# Altium project MIXR Input and Processing.PrjPcb (part 2 of 6)

## Sheet MIXR Processing - STM32 USB-UART Converter.SchDoc: STM32F767 DSP Microcontroller - USB - UART
size B; Organization: Midnight Sun Solar Rayce Car Team; Address1: University of Waterloo; Address2: 200 University Ave W; Address3: Waterloo, ON, Canada; Address4: N2L 3E9; DocumentNumber: 13; SheetNumber: 13; SheetTotal: 15; Website: www.uwmidsun.com; ProjectName: ProjectName
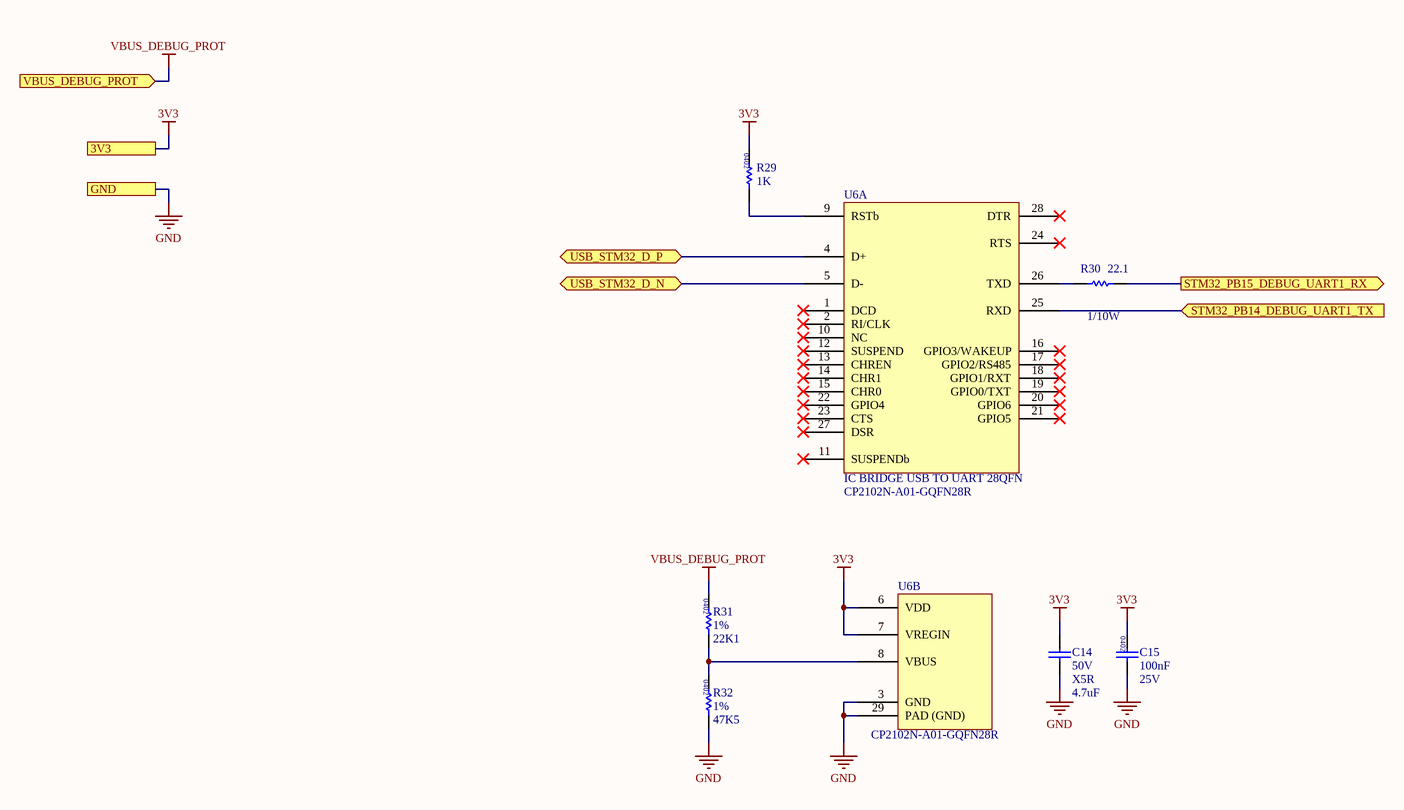
[diagram p2: MIXR Processing - STM32 USB-UART Converter.SchDoc]

### Parts
C14  value 4.7uF  Voltage - Rated: 50V  Temperature Coefficient: X5R  [CAP, 0805]  (hidden comment: CAP CER 4.7UF 50V 10% X5R 0805)
C15  Capacitance: 100nF  Voltage: 25V  [CAP 0402]  (hidden comment: CAP CER 0.1UF 16V X7R 0402)
R29  Resistance: 1K  [RES 0402]  (hidden comment: RES 1K OHM 0.1% 1/16W 0402)
R30  Resistance: 22.1  Power: 1/10W  [RES, 0603]  (hidden comment: RES 22.1 OHM 1% 1/10W 0603)
R31  Tolerance: 1%  Resistance: 22K1  [RES 0402]  (hidden comment: RES 22.1K OHM 1% 1/16W 0402)
R32  Tolerance: 1%  Resistance: 47K5  [RES 0402]  (hidden comment: RES 47.5K OHM 1% 1/16W 0402)
U6  IC BRIDGE USB TO UART 28QFN  Manufacturer Part Number: CP2102N-A01-GQFN28R  [QFN50P500X500X80_HS-29M]  (parts A,B of 2)

### Ports
3V3, GND, STM32_PB14_DEBUG_UART1_TX (in), STM32_PB15_DEBUG_UART1_RX (out), USB_STM32_D_N (bidir), USB_STM32_D_P (bidir), VBUS_DEBUG_PROT (in)

### Nets
3V3: C14.1 C15.1 R29.1 U6.6(VDD) U6.7(VREGIN) ; port 3V3
GND: C14.2 C15.2 R32.2 U6.3(GND) U6.29(PAD_(GND)) ; port GND
VBUS_DEBUG_PROT: R31.1 ; port VBUS_DEBUG_PROT
STM32_PB14_DEBUG_UART1_TX: U6.25(RXD) ; port STM32_PB14_DEBUG_UART1_TX
STM32_PB15_DEBUG_UART1_RX: R30.2 ; port STM32_PB15_DEBUG_UART1_RX
USB_STM32_D_N: U6.5(D-) ; port USB_STM32_D_N
USB_STM32_D_P: U6.4(D+) ; port USB_STM32_D_P
NetR29_2: R29.2 U6.9(RSTb)
NetR30_1: R30.1 U6.26(TXD)
NetR31_2: R31.2 R32.1 U6.8(VBUS)

Not connected (* = marked no-connect by the designer): U6 1(DCD)* 2(RI/CLK)* 10(NC)* 11(SUSPENDb)* 12(SUSPEND)* 13(CHREN)* 14(CHR1)* 15(CHR0)* 16(GPIO3/WAKEUP)* 17(GPIO2/RS485)* 18(GPIO1/RXT)* 19(GPIO0/TXT)* 20(GPIO6)* 21(GPIO5)* 22(GPIO4)* 23(CTS)* 24(RTS)* 27(DSR)* 28(DTR)*

### Notes on the sheet
- PROJECT
- DOCUMENT
- DRAWN BY
- LAST MODIFIED
- PART NUMBER
- REVISION
- SHEET
- VARIANT
- OF

### Library data of the parts
C14 = CAP CER 4.7UF 50V 10% X5R 0805: 4.7µF ±20% 50V Ceramic Capacitor X5R 0805 (2012 Metric); Manufacturer 1: Murata Electronics North America; Manufacturer Part Number 1: GRT21BR61H475ME13L; Description 1: CAP CER 4.7UF 50V X5R 0805; Supplier 1: Digi-Key; Supplier Part Number 1: 490-12395-1-ND; RoHS: RoHS Compliant; Category: Capacitors; Stock 1: 4286; Pricing 1: 1=0.56, 10=0.389, 100=0.2338, 500=0.17536, 1000=0.14808 (CAD); Packaging: Cut Tape (CT); Part Status: Active; Tolerance: ±20%; Operating Temperature: -55°C ~ 85°C; Features: -; Ratings: AEC-Q200; Applications: Automotive; Mounting Type: Surface Mount, MLCC; Package / Case: 0805 (2012 Metric); Size / Dimension: 0.079" L x 0.049" W (2.00mm x 1.25mm); Height - Seated (Max): -; Thickness (Max): 0.057" (1.45mm); Lead Spacing: -; Lead Style: -; ComponentLink1URL: http://search.murata.co.jp/Ceramy/image/img/A01X/G101/ENG/GRT21BR61H475ME13-01.pdf; ComponentLink1Description: http://search.murata.co.jp/Ceramy/image/img/A01X/G101/ENG/GRT21BR61H475ME13-01.pdf
C15 = CAP CER 0.1UF 16V X7R 0402: Cap Ceramic 0.1uF 25V X7R 10% SMD 0402 125C Paper T/R; Manufacturer: Murata; Manufacturer Part Number: GRM155R71E104KE14D; Supplier 1: Digi-Key; Supplier Part Number 1: 490-10698-1-ND; Packaging: Tape and Reel; ComponentLink1URL: http://www.farnell.com/datasheets/2048008.pdf?src-supplier=Farnell; ComponentLink1Description: http://www.farnell.com/datasheets/2048008.pdf?src-supplier=Farnell; Tolerance: 10%; RoHS: Yes; Category: Ceramic Capacitors; Stock 1: 785540; Pricing 1: 1=0.10000, 10=0.03400, 100=0.01520, 500=0.01088, 1000=0.00855, 2500=0.00778, 5000=0.00715 (USD); Mount: Surface Mount; Case/Package: 0402; Weight: 0.000212oz; Case Code (Metric): 1005; Case Code (Imperial): 0402; Dielectric Material: Ceramic; Min Operating Temperature: -55°C; Max Operating Temperature: 125°C; Termination: SMD/SMT; Composition: Ceramic; Voltage Rating (DC): 25V; Package Quantity: 10000; Length: 1mm; Height: 0.5mm; Width: 0.02inch; Thickness: 0.022inch; Depth: 0.5mm; REACH SVHC: Unknown; Lead Free: Lead Free; ComponentLink2URL: http://uk.rs-online.com/webdocs/144c/0900766b8144c113.pdf?src-supplier=RSComponents; ComponentLink2Description: http://uk.rs-online.com/webdocs/144c/0900766b8144c113.pdf?src-supplier=RSComponents; ComponentLink3URL: http://www.farnell.com/datasheets/1872206.pdf?src-supplier=Farnell; ComponentLink3Description: http://www.farnell.com/datasheets/1872206.pdf?src-supplier=Farnell; ComponentLink4URL: http://components.arrow.com/part/dataview/0323_06361249?src-supplier=Arrow+Europe; ComponentLink4Description: http://components.arrow.com/part/dataview/0323_06361249?src-supplier=Arrow+Europe; ComponentLink5URL: http://www.mouser.com/ds/2/281/c02e-2905.pdf?src-supplier=Mouser; ComponentLink5Description: http://www.mouser.com/ds/2/281/c02e-2905.pdf?src-supplier=Mouser; ComponentLink6URL: http://www.farnell.com/datasheets/2048008.pdf?src-supplier=Newark; ComponentLink6Description: http://www.farnell.com/datasheets/2048008.pdf?src-supplier=Newark; ComponentLink7URL: http://psearch.en.murata.com/capacitor/product/GRM155R71E104KE14%23.pdf?src-supplier=Avnet; ComponentLink7Description: http://psearch.en.murata.com/capacitor/product/GRM155R71E104KE14%23.pdf?src-supplier=Avnet; ComponentLink8URL: https://search.murata.co.jp/Ceramy/image/img/A01X/G101/ENG/GRM155R71E104KE14-01.pdf?src-supplier=Digi-Key; ComponentLink8Description: https://search.murata.co.jp/Ceramy/image/img/A01X/G101/ENG/GRM155R71E104KE14-01.pdf?src-supplier=Digi-Key; ComponentLink9URL: http://www.farnell.com/datasheets/2048008.pdf?src-supplier=Element14; ComponentLink9Description: http://www.farnell.com/datasheets/2048008.pdf?src-supplier=Element14; Dielectric: X7R; Voltage Rating: 25V
R29 = RES 1K OHM 0.1% 1/16W 0402: RES SMD 1K OHM 0.1% 1/16W 0402; Manufacturer: Yageo; Manufacturer Part Number: RT0402BRE071KL; Temperature Coefficient: 50ppm/°C; Power Rating: 62.5mW; Voltage Rating: 50V; Max Power Dissipation: 63mW; Supplier 1: Digi-Key; Supplier Part Number 1: YAG2306CT-ND; RoHS: Yes; Category: Chip SMD Resistors; Stock 1: 46127; Pricing 1: 1=0.41000, 10=0.29200, 100=0.11690, 1000=0.05758, 2500=0.05335, 5000=0.04827 (USD); Packaging: Tape and Reel; Tolerance: 0.1%; Composition: Thin Film; Features: Moisture Resistant; ComponentLink1URL: https://datasheet.ciiva.com/2582/pyu-rt-1-to-0-05-rohs-l-5-2582672.pdf?src-supplier=Digi-Key; ComponentLink1Description: https://datasheet.ciiva.com/2582/pyu-rt-1-to-0-05-rohs-l-5-2582672.pdf?src-supplier=Digi-Key; Case/Package: 0402; Weight: 2.3E-05oz; Case Code (Metric): 1005; Case Code (Imperial): 0402; Min Operating Temperature: -55°C; Max Operating Temperature: 125°C; Package Quantity: 10000; Number of Terminations: 2; Termination: SMD/SMT; Military Standard: Not; Voltage Rating (DC): 50V; Length: 1mm; Height: 0.014inch; Width: 0.02inch; Depth: 0.5mm; Lead Free: Lead Free; ComponentLink2URL: https://datasheet.ciiva.com/12796/pyu-rt-1-to-0-05-rohs-l-4-12796476.pdf?src-supplier=Mouser; ComponentLink2Description: https://datasheet.ciiva.com/12796/pyu-rt-1-to-0-05-rohs-l-4-12796476.pdf?src-supplier=Mouser
R30 = RES 22.1 OHM 1% 1/10W 0603: 22.1 Ohm ±1% 0.1W, 1/10W Chip Resistor 0603 (1608 Metric) Moisture Resistant Thick Film; Manufacturer 1: Yageo; Manufacturer Part Number 1: RC0603FR-0722R1L; Temperature Coefficient: ±100ppm/°C; Supplier 1: Digi-Key; Supplier Part Number 1: 311-22.1HRCT-ND; Packaging: Cut Tape (CT); Composition: Thick Film; ComponentLink1URL: http://www.yageo.com/documents/recent/PYu-RC_Group_51_RoHS_L_7.pdf; ComponentLink1Description: http://www.yageo.com/documents/recent/PYu-RC_Group_51_RoHS_L_7.pdf; Tolerance: ±1%; Part Status: Active; Operating Temperature: -55°C ~ 155°C; Package / Case: 0603 (1608 Metric); Supplier Device Package: 0603; Size / Dimension: 0.063" L x 0.031" W (1.60mm x 0.80mm); Height - Seated (Max): 0.022" (0.55mm); Failure Rate: -
R31 = RES 22.1K OHM 1% 1/16W 0402: RES SMD 22.1K OHM 1% 1/16W 0402; Manufacturer: Stackpole Electronics; Manufacturer Part Number: RMCF0402FT22K1; Max Power Dissipation: 63mW; Temperature Coefficient: 100ppm/°C; Supplier 1: Digi-Key; RoHS: Yes; Category: Chip SMD Resistors; Stock 1: 130160; Pricing 1: 1=0.10000, 10=0.01400, 100=0.00580, 1000=0.00262, 2500=0.00228, 5000=0.00188 (USD); Mount: Surface Mount; Case/Package: 0402; Case Code (Metric): 1005; Case Code (Imperial): 0402; Contact Plating: Tin,Matte; Min Operating Temperature: -55°C; Max Operating Temperature: 155°C; Packaging: Tape and Reel; Composition: Thick Film; Number of Terminations: 2; Features: Automotive AEC-Q200; Length: 0.039inch; Height: 0.016inch; Width: 0.02inch; Radiation Hardening: No; Lead Free: Lead Free; ComponentLink1URL: http://components.arrow.com/part/dataview/50500388S32218N1174?src-supplier=Arrow; ComponentLink1Description: http://components.arrow.com/part/dataview/50500388S32218N1174?src-supplier=Arrow; ComponentLink2URL: https://www.seielect.com/Catalog/SEI-RMCF_RMCP.pdf?src-supplier=Digi-Key; ComponentLink2Description: https://www.seielect.com/Catalog/SEI-RMCF_RMCP.pdf?src-supplier=Digi-Key; ComponentLink3URL: https://www.seielect.com/catalog/SEI-RMCF_RMCP.pdf?src-supplier=Avnet; ComponentLink3Description: https://www.seielect.com/catalog/SEI-RMCF_RMCP.pdf?src-supplier=Avnet; ComponentLink4URL: https://www.seielect.com/catalog/SEI-Packaging.pdf?src-supplier=Digi-Key; ComponentLink4Description: https://www.seielect.com/catalog/SEI-Packaging.pdf?src-supplier=Digi-Key; Supplier Part Number 1: RMCF0402FT22K1CT-ND
R32 = RES 47.5K OHM 1% 1/16W 0402: RES SMD 47.5K OHM 1% 1/16W 0402; Manufacturer: Yageo; Manufacturer Part Number: RC0402FR-0747K5L; Power Rating: 62.5mW; Temperature Coefficient: 100ppm/°C; Voltage Rating: 50V; Supplier 1: Digi-Key; RoHS: Yes; Category: Chip SMD Resistors; Stock 1: 1151028; Pricing 1: 1=0.10000, 10=0.01600, 100=0.00640, 1000=0.00289, 2500=0.00251, 5000=0.00207 (USD); Case/Package: 0402; Case Code (Metric): 1005; Case Code (Imperial): 0402; Min Operating Temperature: -55°C; Max Operating Temperature: 155°C; Packaging: Tape and Reel; Composition: Thick Film; Military Standard: Not; Length: 1mm; Depth: 0.5mm; Lead Free: Lead Free; ComponentLink1URL: https://datasheet.ciiva.com/16746/pyu-rc0402-51-rohs-l-6-r-16746316.pdf?src-supplier=Future+Electronics; ComponentLink1Description: https://datasheet.ciiva.com/16746/pyu-rc0402-51-rohs-l-6-r-16746316.pdf?src-supplier=Future+Electronics; Supplier Part Number 1: 311-47.5KLRCT-ND; Termination: SMD/SMT; Voltage Rating (DC): 50V; REACH SVHC: No SVHC; ComponentLink2URL: https://datasheet.ciiva.com/46394/1018594-46394942.pdf?src-supplier=Element14; ComponentLink2Description: https://datasheet.ciiva.com/46394/1018594-46394942.pdf?src-supplier=Element14; ComponentLink3URL: https://datasheet.ciiva.com/12667/pyu-rc0402-51-rohs-l-6-r-12667103.pdf?src-supplier=Mouser; ComponentLink3Description: https://datasheet.ciiva.com/12667/pyu-rc0402-51-rohs-l-6-r-12667103.pdf?src-supplier=Mouser
U6 = IC BRIDGE USB TO UART 28QFN: Manufacturer: Silicon Labs; Supplier 1: Digi-Key; RoHS: No; Stock 1: 2155; Pricing 1: 1=1.40000, 25=1.35160, 100=1.29950 (USD); ComponentLink1URL: https://www.silabs.com/documents/public/data-sheets/cp2102n-datasheet.pdf?src-supplier=Digi-Key; ComponentLink1Description: https://www.silabs.com/documents/public/data-sheets/cp2102n-datasheet.pdf?src-supplier=Digi-Key; Supplier Part Number 1: 336-4738-1-ND

## Sheet MIXR Processing - STM32 DSP Microcontroller.SchDoc: STM32F767 DSP Microcontroller - GPIOs
size B; DocumentNumber: 10; SheetNumber: 10; SheetTotal: 15
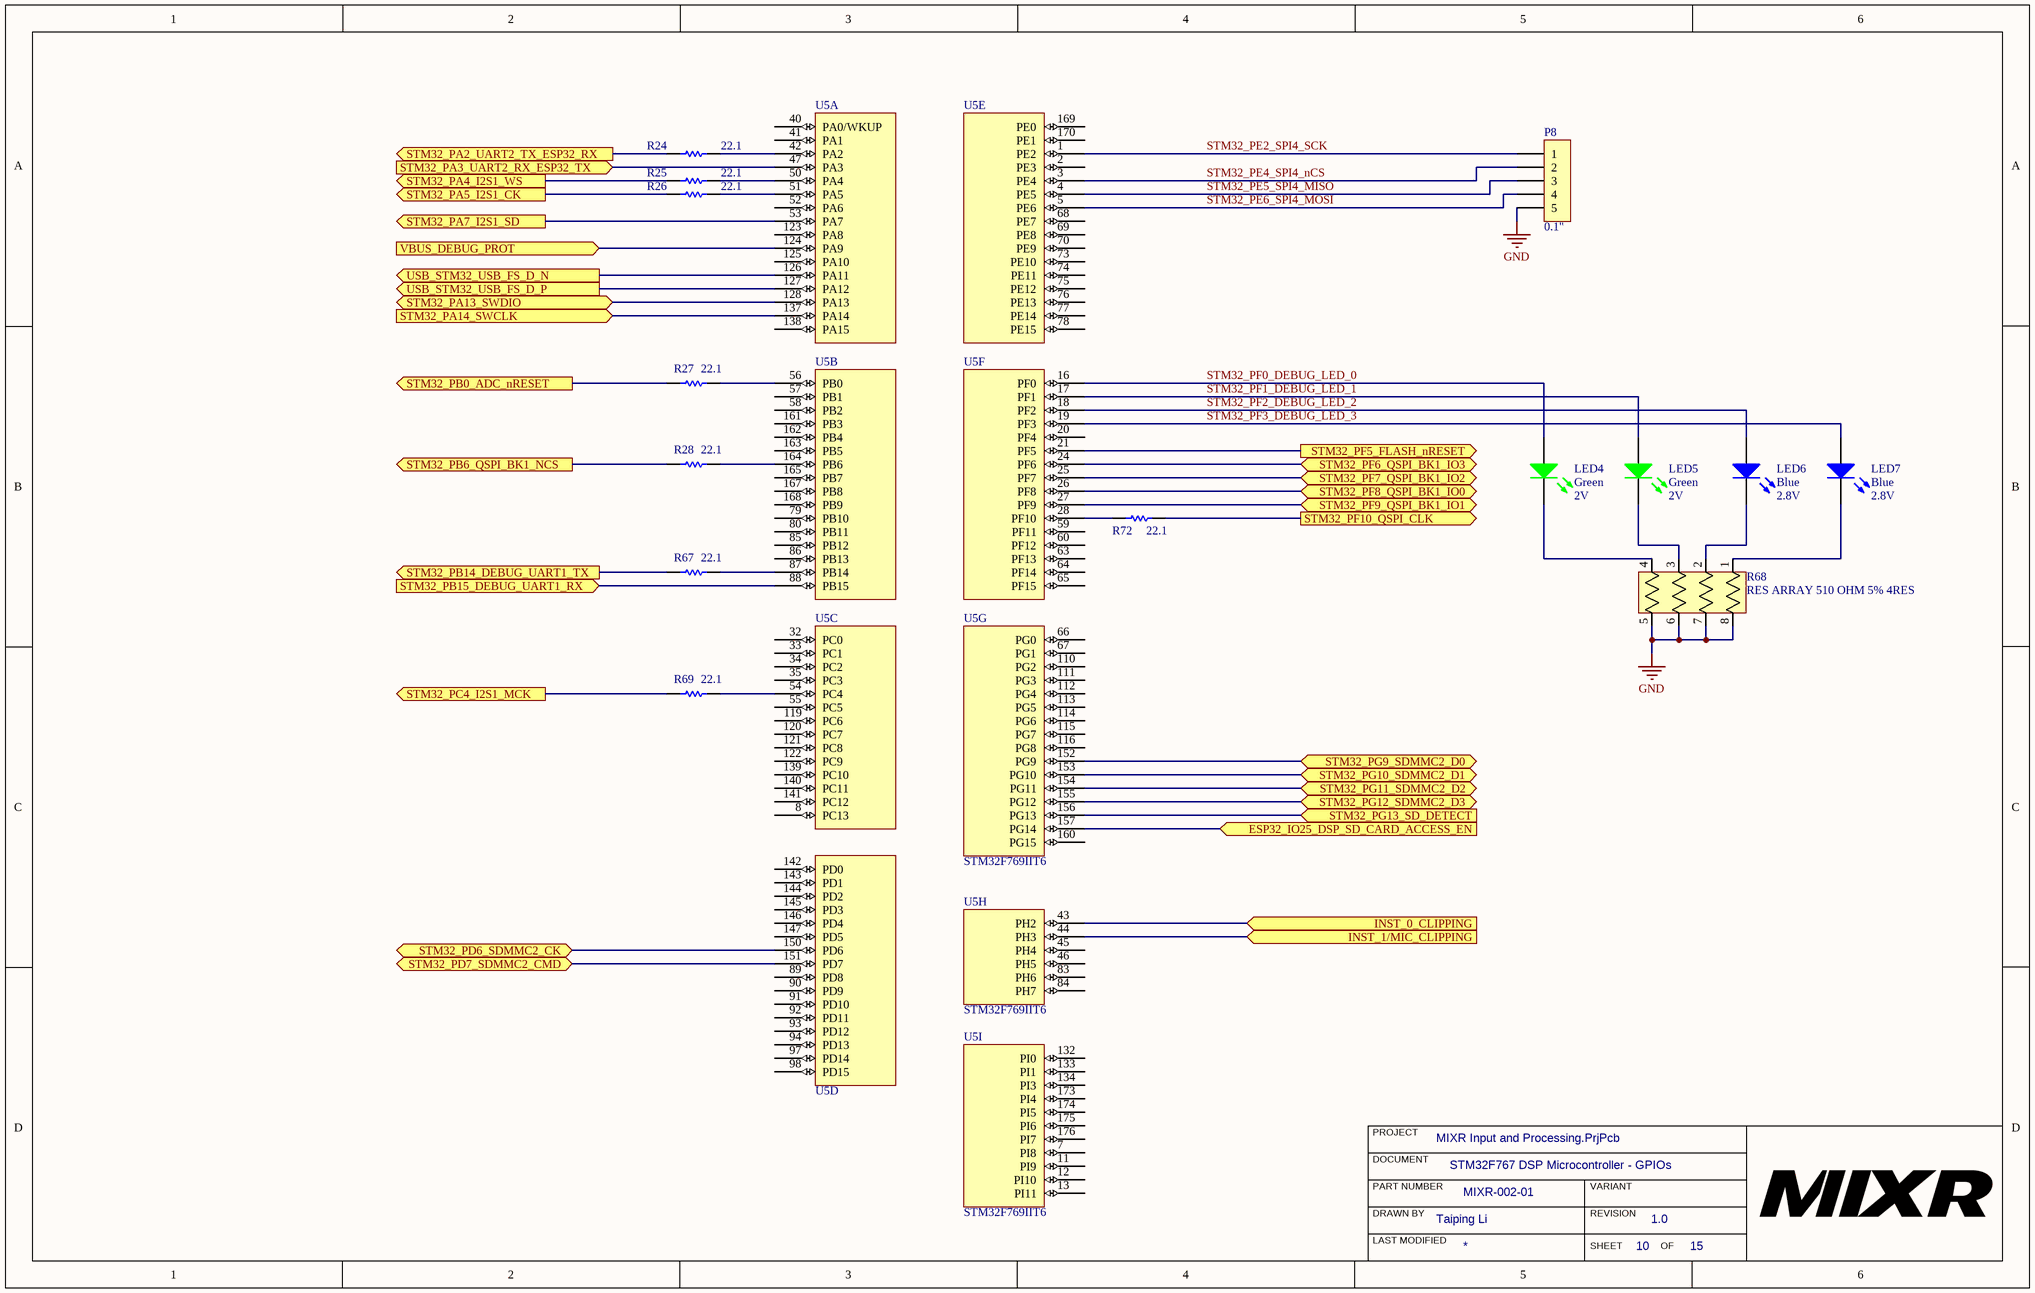
[diagram p3: MIXR Processing - STM32 DSP Microcontroller.SchDoc]

### Parts
LED4  Color: Green  Voltage - Forward (Vf) (Typ): 2V  [LED_0603]  (hidden comment: LED GREEN CLEAR 2V 0603)
LED5  Color: Green  Voltage - Forward (Vf) (Typ): 2V  [LED_0603]  (hidden comment: LED GREEN CLEAR 2V 0603)
LED6  Color: Blue  Voltage - Forward (Vf) (Typ): 2.8V  [LED_0603]  (hidden comment: LED BLUE CLEAR 2.8V 0603)
LED7  Color: Blue  Voltage - Forward (Vf) (Typ): 2.8V  [LED_0603]  (hidden comment: LED BLUE CLEAR 2.8V 0603)
P8  0.1"  [CONN, 5POS 1.23" 0.100" MALE Header]
R24  Resistance: 22.1  [RES, 0603]  (hidden comment: RES 22.1 OHM 1% 1/10W 0603)
R25  Resistance: 22.1  [RES, 0603]  (hidden comment: RES 22.1 OHM 1% 1/10W 0603)
R26  Resistance: 22.1  [RES, 0603]  (hidden comment: RES 22.1 OHM 1% 1/10W 0603)
R27  Resistance: 22.1  [RES, 0603]  (hidden comment: RES 22.1 OHM 1% 1/10W 0603)
R28  Resistance: 22.1  [RES, 0603]  (hidden comment: RES 22.1 OHM 1% 1/10W 0603)
R67  Resistance: 22.1  [RES, 0603]  (hidden comment: RES 22.1 OHM 1% 1/10W 0603)
R68  RES ARRAY 510 OHM 5% 4RES  [RES ARRAY 4 POS 0804]
R69  Resistance: 22.1  [RES, 0603]  (hidden comment: RES 22.1 OHM 1% 1/10W 0603)
R72  Resistance: 22.1  [RES, 0603]  (hidden comment: RES 22.1 OHM 1% 1/10W 0603)
U5  IC MCU STM32F769II 176-LQFP  [TSQFP50P2600X2600X160-176M]  (value not drawn)  (parts A,B,C,D,E,F,G,H,I of 11)

### Ports
ESP32_IO25_DSP_SD_CARD_ACCESS_EN (in), INST_0_CLIPPING (in), INST_1/MIC_CLIPPING (in), STM32_PA2_UART2_TX_ESP32_RX (out), STM32_PA3_UART2_RX_ESP32_TX (in), STM32_PA4_I2S1_WS (out), STM32_PA5_I2S1_CK (out), STM32_PA7_I2S1_SD (out), STM32_PA13_SWDIO (bidir), STM32_PA14_SWCLK (in), STM32_PB0_ADC_nRESET (out), STM32_PB6_QSPI_BK1_NCS (out), STM32_PB14_DEBUG_UART1_TX (out), STM32_PB15_DEBUG_UART1_RX (in), STM32_PC4_I2S1_MCK (out), STM32_PD6_SDMMC2_CK (bidir), STM32_PD7_SDMMC2_CMD (bidir), STM32_PF5_FLASH_nRESET (out), STM32_PF6_QSPI_BK1_IO3 (bidir), STM32_PF7_QSPI_BK1_IO2 (bidir), STM32_PF8_QSPI_BK1_IO0 (bidir), STM32_PF9_QSPI_BK1_IO1 (bidir), STM32_PF10_QSPI_CLK (out), STM32_PG9_SDMMC2_D0 (bidir), STM32_PG10_SDMMC2_D1 (bidir), STM32_PG11_SDMMC2_D2 (bidir), STM32_PG12_SDMMC2_D3 (bidir), STM32_PG13_SD_DETECT (in), USB_STM32_USB_FS_D_N (out), USB_STM32_USB_FS_D_P (out), VBUS_DEBUG_PROT (in)

### Nets
GND: P8.5 R68.5 R68.6 R68.7 R68.8
VBUS_DEBUG_PROT: U5.124(PA9) ; port VBUS_DEBUG_PROT
ESP32_IO25_DSP_SD_CARD_ACCESS_EN: U5.157(PG14) ; port ESP32_IO25_DSP_SD_CARD_ACCESS_EN
INST_0_CLIPPING: U5.43(PH2) ; port INST_0_CLIPPING
INST_1/MIC_CLIPPING: U5.44(PH3) ; port INST_1/MIC_CLIPPING
STM32_PA2_UART2_TX_ESP32_RX: R24.1 ; port STM32_PA2_UART2_TX_ESP32_RX
STM32_PA3_UART2_RX_ESP32_TX: U5.47(PA3) ; port STM32_PA3_UART2_RX_ESP32_TX
STM32_PA4_I2S1_WS: R25.1 ; port STM32_PA4_I2S1_WS
STM32_PA5_I2S1_CK: R26.1 ; port STM32_PA5_I2S1_CK
STM32_PA7_I2S1_SD: U5.53(PA7) ; port STM32_PA7_I2S1_SD
STM32_PA13_SWDIO: U5.128(PA13) ; port STM32_PA13_SWDIO
STM32_PA14_SWCLK: U5.137(PA14) ; port STM32_PA14_SWCLK
STM32_PB0_ADC_nRESET: R27.1 ; port STM32_PB0_ADC_nRESET
STM32_PB6_QSPI_BK1_NCS: R28.1 ; port STM32_PB6_QSPI_BK1_NCS
STM32_PB14_DEBUG_UART1_TX: R67.1 ; port STM32_PB14_DEBUG_UART1_TX
STM32_PB15_DEBUG_UART1_RX: U5.88(PB15) ; port STM32_PB15_DEBUG_UART1_RX
STM32_PC4_I2S1_MCK: R69.1 ; port STM32_PC4_I2S1_MCK
STM32_PD6_SDMMC2_CK: U5.150(PD6) ; port STM32_PD6_SDMMC2_CK
STM32_PD7_SDMMC2_CMD: U5.151(PD7) ; port STM32_PD7_SDMMC2_CMD
STM32_PE2_SPI4_SCK: P8.1 U5.1(PE2)
STM32_PE4_SPI4_nCS: P8.2 U5.3(PE4)
STM32_PE5_SPI4_MISO: P8.3 U5.4(PE5)
STM32_PE6_SPI4_MOSI: P8.4 U5.5(PE6)
STM32_PF0_DEBUG_LED_0: LED4.1(A) U5.16(PF0)
STM32_PF1_DEBUG_LED_1: LED5.1(A) U5.17(PF1)
STM32_PF2_DEBUG_LED_2: LED6.1(A) U5.18(PF2)
STM32_PF3_DEBUG_LED_3: LED7.1(A) U5.19(PF3)
STM32_PF5_FLASH_nRESET: U5.21(PF5) ; port STM32_PF5_FLASH_nRESET
STM32_PF6_QSPI_BK1_IO3: U5.24(PF6) ; port STM32_PF6_QSPI_BK1_IO3
STM32_PF7_QSPI_BK1_IO2: U5.25(PF7) ; port STM32_PF7_QSPI_BK1_IO2
STM32_PF8_QSPI_BK1_IO0: U5.26(PF8) ; port STM32_PF8_QSPI_BK1_IO0
STM32_PF9_QSPI_BK1_IO1: U5.27(PF9) ; port STM32_PF9_QSPI_BK1_IO1
STM32_PF10_QSPI_CLK: R72.2 ; port STM32_PF10_QSPI_CLK
STM32_PG9_SDMMC2_D0: U5.152(PG9) ; port STM32_PG9_SDMMC2_D0
STM32_PG10_SDMMC2_D1: U5.153(PG10) ; port STM32_PG10_SDMMC2_D1
STM32_PG11_SDMMC2_D2: U5.154(PG11) ; port STM32_PG11_SDMMC2_D2
STM32_PG12_SDMMC2_D3: U5.155(PG12) ; port STM32_PG12_SDMMC2_D3
STM32_PG13_SD_DETECT: U5.156(PG13) ; port STM32_PG13_SD_DETECT
USB_STM32_USB_FS_D_N: U5.126(PA11) ; port USB_STM32_USB_FS_D_N
USB_STM32_USB_FS_D_P: U5.127(PA12) ; port USB_STM32_USB_FS_D_P
NetLED4_2: LED4.2(K) R68.4
NetLED5_2: LED5.2(K) R68.3
NetLED6_2: LED6.2(K) R68.2
NetLED7_2: LED7.2(K) R68.1
NetR24_2: R24.2 U5.42(PA2)
NetR25_2: R25.2 U5.50(PA4)
NetR26_2: R26.2 U5.51(PA5)
NetR27_2: R27.2 U5.56(PB0)
NetR28_2: R28.2 U5.164(PB6)
NetR67_2: R67.2 U5.87(PB14)
NetR69_2: R69.2 U5.54(PC4)
NetR72_1: R72.1 U5.28(PF10)

Not connected (* = marked no-connect by the designer): U5 2(PE3) 7(PI8) 8(PC13) 11(PI9) 12(PI10) 13(PI11) 20(PF4) 32(PC0) 33(PC1) 34(PC2) 35(PC3) 40(PA0/WKUP) 41(PA1) 45(PH4) 46(PH5) 52(PA6) 55(PC5) 57(PB1) 58(PB2) 59(PF11) 60(PF12) 63(PF13) 64(PF14) 65(PF15) 66(PG0) 67(PG1) 68(PE7) 69(PE8) 70(PE9) 73(PE10) 74(PE11) 75(PE12) 76(PE13) 77(PE14) 78(PE15) 79(PB10) 80(PB11) 83(PH6) 84(PH7) 85(PB12) 86(PB13) 89(PD8) 90(PD9) 91(PD10) 92(PD11) 93(PD12) 94(PD13) 97(PD14) 98(PD15) 110(PG2) 111(PG3) 112(PG4) 113(PG5) 114(PG6) 115(PG7) 116(PG8) 119(PC6) 120(PC7) 121(PC8) 122(PC9) 123(PA8) 125(PA10) 132(PI0) 133(PI1) 134(PI3) 138(PA15) 139(PC10) 140(PC11) 141(PC12) 142(PD0) 143(PD1) 144(PD2) 145(PD3) 146(PD4) 147(PD5) 160(PG15) 161(PB3) 162(PB4) 163(PB5) 165(PB7) 167(PB8) 168(PB9) 169(PE0) 170(PE1) 173(PI4) 174(PI5) 175(PI6) 176(PI7)

### Notes on the sheet
- PROJECT
- DOCUMENT
- DRAWN BY
- LAST MODIFIED
- PART NUMBER
- REVISION
- SHEET
- VARIANT
- OF

### Library data of the parts
LED4 LED5 = LED GREEN CLEAR 2V 0603: Green 572nm LED Indication - Discrete 2V 0603 (1608 Metric); Manufacturer: Wurth Electronics Inc.; Manufacturer Part Number: 150060VS75000; Lens Color: Colorless; Millicandela Rating: 40mcd; Lens Style/Size: Rectangle with Flat Top, 1.10mm x 0.70mm; Current - Test: 20mA; Viewing Angle: 140°; Wavelength - Dominant: 570nm; Supplier 1: Digi-Key; RoHS: RoHS Compliant; Category: Optoelectronics; Stock 1: 9408; Pricing 1: 1=0.21, 100=0.1617, 500=0.13964 (CAD); Packaging: Cut Tape (CT); Part Status: Active; Lens Transparency: Clear; Mounting Type: Surface Mount; Wavelength - Peak: 572nm; Features: -; Package / Case: 0603 (1608 Metric); Supplier Device Package: 0603; Size / Dimension: 1.60mm L x 0.80mm W; Height (Max): 0.80mm; ComponentLink1URL: http://katalog.we-online.de/led/datasheet/150060VS75000.pdf; ComponentLink1Description: http://katalog.we-online.de/led/datasheet/150060VS75000.pdf; Supplier Part Number 1: 732-4980-1-ND
LED6 LED7 = LED BLUE CLEAR 2.8V 0603: Blue 470nm LED Indication - Discrete 2.8V 0603 (1608 Metric); Manufacturer 1: Lite-On Inc.; Manufacturer Part Number 1: LTST-C193TBKT-5A; Lens Color: Colorless; Millicandela Rating: 15mcd; Lens Style/Size: Rectangle with Flat Top, 1.15mm x 0.80mm; Current - Test: 5mA; Viewing Angle: 130°; Wavelength - Peak: 468nm; Supplier 1: Digi-Key; Supplier Part Number 1: 160-1827-1-ND; Packaging: Cut Tape (CT); Part Status: Active; Lens Transparency: Clear; Mounting Type: Surface Mount; Wavelength - Dominant: 470nm; Package / Case: 0603 (1608 Metric); Supplier Device Package: Chip LED; Size / Dimension: 1.60mm L x 0.80mm W; Height (Max): 0.45mm; ComponentLink1URL: http://optoelectronics.liteon.com/upload/download/DS22-2004-060/P_100_LTST-C193TBKT-5A.pdf; ComponentLink1Description: http://optoelectronics.liteon.com/upload/download/DS22-2004-060/P_100_LTST-C193TBKT-5A.pdf
P8 = CONN 5POS 0.1" 1" MALE HEADER: CONN HEADER 5POS .100" SNGL; Manufacturer: Samtec; Manufacturer Part Number: TSW-105-20-T-S; Number of Positions: 5; Gender: Male; Connector Type: Male Pin; Pitch: 0.1inch; RoHS: Yes; Category: Headers and Wire Housings; Stock 1: 939; Pricing 1: 1=0.45000, 10=0.42300, 100=0.32430, 500=0.28200, 1000=0.23265, 5000=0.20445, 10000=0.19035 (USD); Mount: Through Hole; Color: Black; Contact Plating: Tin; Contact Material: Bronze; Package Quantity: 1; Number of Rows: 1; Packaging: Rail/Tube; Termination: Solder; Number of Contacts: 5; Contact Mating Length: 1.02inch; Radiation Hardening: No; REACH SVHC: No SVHC; Lead Free: Lead Free; ComponentLink1URL: https://datasheet.ciiva.com/739/tsw-xxx-xx-xxx-x-xx-xxx-mkt-739939.pdf?src-supplier=Digi-Key; ComponentLink1Description: https://datasheet.ciiva.com/739/tsw-xxx-xx-xxx-x-xx-xxx-mkt-739939.pdf?src-supplier=Digi-Key; ComponentLink2URL: https://datasheet.ciiva.com/29947/htsw-th-29947990.pdf?src-supplier=Avnet; ComponentLink2Description: https://datasheet.ciiva.com/29947/htsw-th-29947990.pdf?src-supplier=Avnet; Supplier 1: Digi-Key; Supplier Part Number 1: SAM9000-ND
R24-R28 R67 R69 R72 = RES 22.1 OHM 1% 1/10W 0603: as R30 on sheet MIXR Processing - STM32 USB-UART Converter; Supplier 1: Digi-Key; Supplier Part Number 1: 311-22.1HRCT-ND; Packaging: Cut Tape (CT); Composition: Thick Film; ComponentLink1URL: http://www.yageo.com/documents/recent/PYu-RC_Group_51_RoHS_L_7.pdf; ComponentLink1Description: http://www.yageo.com/documents/recent/PYu-RC_Group_51_RoHS_L_7.pdf; Tolerance: ±1%; Part Status: Active; Operating Temperature: -55°C ~ 155°C; Package / Case: 0603 (1608 Metric); Supplier Device Package: 0603; Size / Dimension: 0.063" L x 0.031" W (1.60mm x 0.80mm); Height - Seated (Max): 0.022" (0.55mm); Failure Rate: -; Power: 1/10W
R68 = RES ARRAY 510 OHM 5% 4RES EXB-N8V511JX: RES ARRAY SMD 510 OHM 5% 4RES EXB-N8V511JX; Manufacturer: Panasonic Electronic Components; Circuit Type: Isolated; Resistance (Ohms): 510; Power Per Element: 31mW; Temperature Coefficient: ±200ppm/°C; Supplier 1: Digi-Key; Manufacturer Part Number: EXB-N8V511JX; RoHS: RoHS Compliant; Category: Resistors; Stock 1: 25621; Packaging: Cut Tape (CT); Part Status: Active; Tolerance: ±5%; Operating Temperature: -55°C ~ 125°C; Applications: -; Mounting Type: Surface Mount; Package / Case: 0804, Concave, Long Side Terminals; Supplier Device Package: 0804; Size / Dimension: 0.079" L x 0.039" W (2.00mm x 1.00mm); Height - Seated (Max): 0.022" (0.55mm); ComponentLink1URL: https://industrial.panasonic.com/cdbs/www-data/pdf/AOC0000/AOC0000C14.pdf; ComponentLink1Description: https://industrial.panasonic.com/cdbs/www-data/pdf/AOC0000/AOC0000C14.pdf; Supplier Part Number 1: Y10511CT-ND; Pricing 1: 1=0.15, 10=0.101, 25=0.0696, 50=0.0544, 100=0.0389, 250=0.03024, 500=0.02404, 1000=0.01706, 5000=0.01319 (CAD)
U5 = IC MCU STM32F769II 176-LQFP: ARM® Cortex®-M7 STM32F7 Microcontroller IC 32-Bit 216MHz 2MB (2M x 8) FLASH 176-LQFP (24x24); Manufacturer: STMicroelectronics; Manufacturer Part Number: STM32F769IIT6; Supplier 1: Digi-Key; RoHS: No; Category: Microcontrollers; Stock 1: 295; Pricing 1: 1=12.69000, 10=11.66300, 25=11.18000, 100=9.85040, 250=9.36696, 500=8.76264, 1000=8.03746 (USD); ComponentLink1URL: http://www.st.com/content/ccc/resource/technical/document/errata_sheet/group0/23/a6/11/0b/30/24/46/a5/DM00257543/files/DM00257543.pdf/jcr:content/translations/en.DM00257543.pdf?src-supplier=Digi-Key; ComponentLink1Description: http://www.st.com/content/ccc/resource/technical/document/errata_sheet/group0/23/a6/11/0b/30/24/46/a5/DM00257543/files/DM00257543.pdf/jcr:content/translations/en.DM00257543.pdf?src-supplier=Digi-Key; Supplier Part Number 1: 497-16649-ND

## Sheet MIXR Processing - SD Card.SchDoc: Micro SD Card & Mux
size B; DocumentNumber: 15; SheetNumber: 15; SheetTotal: 15
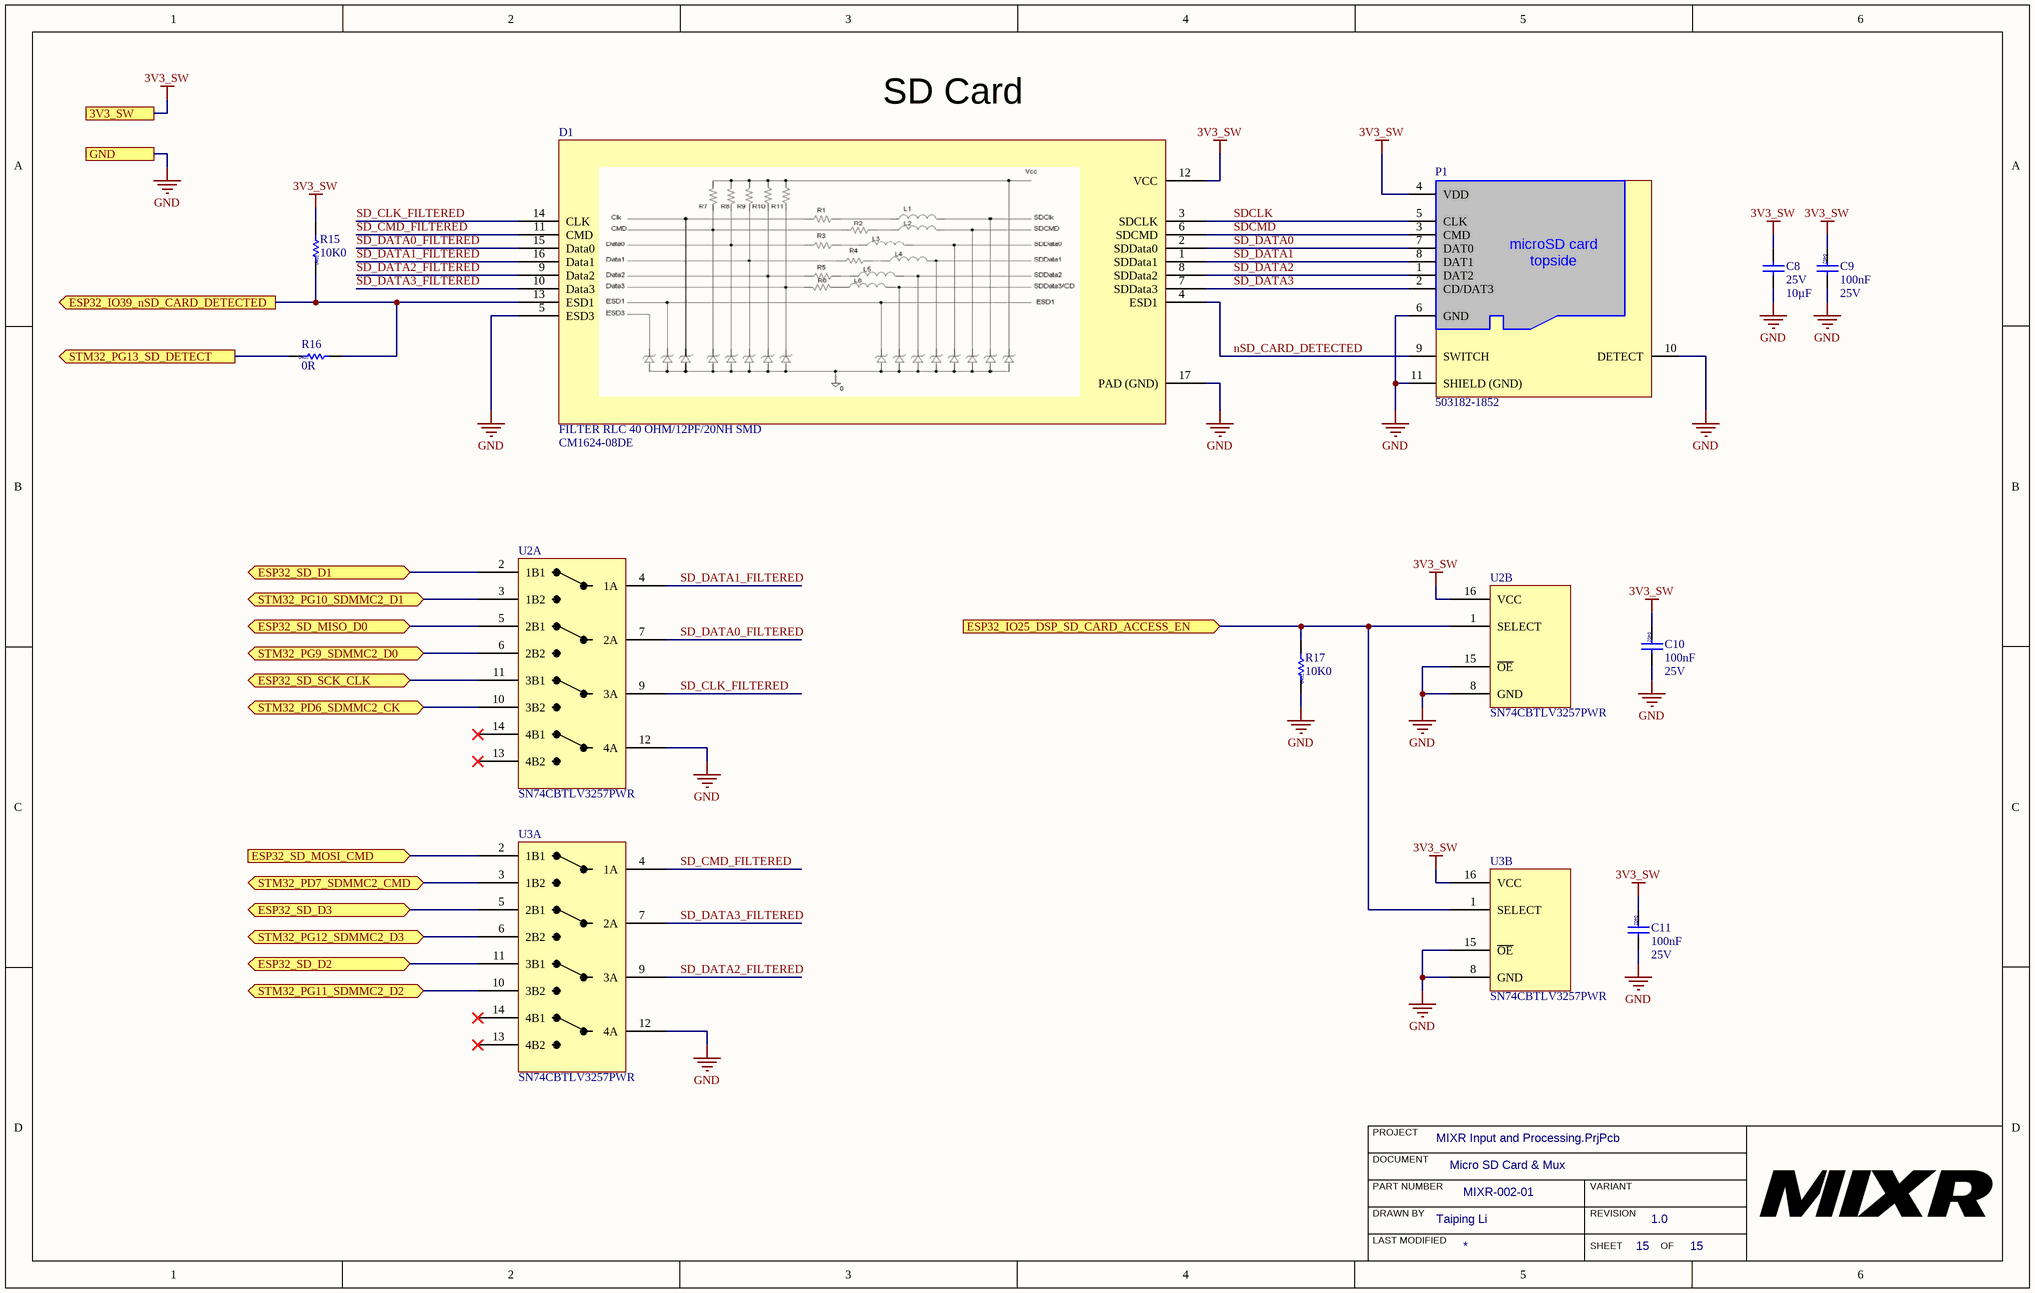
[diagram p4: MIXR Processing - SD Card.SchDoc]

### Parts
C8  Voltage - Rated: 25V  Capacitance: 10µF  [CAP, 0805]  (hidden comment: CAP CER 10uF 25V 10% X5R 0805)
C9  Capacitance: 100nF  Voltage: 25V  [CAP 0402]  (hidden comment: CAP CER 0.1UF 16V X7R 0402)
C10  Capacitance: 100nF  Voltage: 25V  [CAP 0402]  (hidden comment: CAP CER 0.1UF 16V X7R 0402)
C11  Capacitance: 100nF  Voltage: 25V  [CAP 0402]  (hidden comment: CAP CER 0.1UF 16V X7R 0402)
D1  FILTER RLC 40 OHM/12PF/20NH SMD  Manufacturer Part Number 1: CM1624-08DE  [QFN0P135X330X55_HS-17M]
P1  Manufacturer Part Number: 503182-1852  [CONN MICRO-SD HOLDER MOLEX 503182-1852]  (hidden comment: CONN MICRO-SD ULTRA-LOW 8CKT)
R15  Resistance: 10K0  [RES 0402]  (hidden comment: RES 10K OHM 1% 1/16W 0402)
R16  Resistance: 0R  [RES 0402]  (hidden comment: RES 0.0 OHM 1% 1/16W 0402)
R17  Resistance: 10K0  [RES 0402]  (hidden comment: RES 10K OHM 1% 1/16W 0402)
U2  Manufacturer Part Number: SN74CBTLV3257PWR  [TSOP65P640X120-16N]  (hidden comment: IC MUX/DEMUX 4-BIT 1-OF-2 16-TSSOP)  (parts A,B of 2)
U3  Manufacturer Part Number: SN74CBTLV3257PWR  [TSOP65P640X120-16N]  (hidden comment: IC MUX/DEMUX 4-BIT 1-OF-2 16-TSSOP)  (parts A,B of 2)

### Ports
3V3_SW, ESP32_IO25_DSP_SD_CARD_ACCESS_EN (in), ESP32_IO39_nSD_CARD_DETECTED (out), ESP32_SD_D1 (bidir), ESP32_SD_D2 (bidir), ESP32_SD_D3 (bidir), ESP32_SD_MISO_D0 (bidir), ESP32_SD_MOSI_CMD (in), ESP32_SD_SCK_CLK (bidir), GND, STM32_PD6_SDMMC2_CK (bidir), STM32_PD7_SDMMC2_CMD (bidir), STM32_PG9_SDMMC2_D0 (bidir), STM32_PG10_SDMMC2_D1 (bidir), STM32_PG11_SDMMC2_D2 (bidir), STM32_PG12_SDMMC2_D3 (bidir), STM32_PG13_SD_DETECT (out)

### Nets
3V3_SW: C8.1 C9.1 C10.1 C11.1 D1.12(VCC) P1.4(VDD) R15.2 U2.16(VCC) U3.16(VCC) ; port 3V3_SW
GND: C8.2 C9.2 C10.2 C11.2 D1.5(ESD3) D1.17(PAD_(GND)) P1.6(GND) P1.10(DETECT) P1.11(SHIELD_(GND)) R17.1 U2.8(GND) U2.12(4A) U2.15(~{OE}) U3.8(GND) U3.12(4A) U3.15(~{OE}) ; port GND
ESP32_IO25_DSP_SD_CARD_ACCESS_EN: R17.2 U2.1(SELECT) U3.1(SELECT) ; port ESP32_IO25_DSP_SD_CARD_ACCESS_EN
ESP32_IO39_nSD_CARD_DETECTED: D1.13(ESD1) R15.1 R16.2 ; port ESP32_IO39_nSD_CARD_DETECTED
ESP32_SD_D1: U2.2(1B1) ; port ESP32_SD_D1
ESP32_SD_D2: U3.11(3B1) ; port ESP32_SD_D2
ESP32_SD_D3: U3.5(2B1) ; port ESP32_SD_D3
ESP32_SD_MISO_D0: U2.5(2B1) ; port ESP32_SD_MISO_D0
ESP32_SD_MOSI_CMD: U3.2(1B1) ; port ESP32_SD_MOSI_CMD
ESP32_SD_SCK_CLK: U2.11(3B1) ; port ESP32_SD_SCK_CLK
nSD_CARD_DETECTED: D1.4(ESD1) P1.9(SWITCH)
SD_CLK_FILTERED: D1.14(CLK) U2.9(3A)
SD_CMD_FILTERED: D1.11(CMD) U3.4(1A)
SD_DATA0: D1.2(SDData0) P1.7(DAT0)
SD_DATA0_FILTERED: D1.15(Data0) U2.7(2A)
SD_DATA1: D1.1(SDData1) P1.8(DAT1)
SD_DATA1_FILTERED: D1.16(Data1) U2.4(1A)
SD_DATA2: D1.8(SDData2) P1.1(DAT2)
SD_DATA2_FILTERED: D1.9(Data2) U3.9(3A)
SD_DATA3: D1.7(SDData3) P1.2(CD/DAT3)
SD_DATA3_FILTERED: D1.10(Data3) U3.7(2A)
SDCLK: D1.3(SDCLK) P1.5(CLK)
SDCMD: D1.6(SDCMD) P1.3(CMD)
STM32_PD6_SDMMC2_CK: U2.10(3B2) ; port STM32_PD6_SDMMC2_CK
STM32_PD7_SDMMC2_CMD: U3.3(1B2) ; port STM32_PD7_SDMMC2_CMD
STM32_PG9_SDMMC2_D0: U2.6(2B2) ; port STM32_PG9_SDMMC2_D0
STM32_PG10_SDMMC2_D1: U2.3(1B2) ; port STM32_PG10_SDMMC2_D1
STM32_PG11_SDMMC2_D2: U3.10(3B2) ; port STM32_PG11_SDMMC2_D2
STM32_PG12_SDMMC2_D3: U3.6(2B2) ; port STM32_PG12_SDMMC2_D3
STM32_PG13_SD_DETECT: R16.1 ; port STM32_PG13_SD_DETECT

Not connected (* = marked no-connect by the designer): U2 13(4B2)* 14(4B1)*; U3 13(4B2)* 14(4B1)*

### Notes on the sheet
- SD Card
- PROJECT
- DOCUMENT
- DRAWN BY
- LAST MODIFIED
- PART NUMBER
- REVISION
- SHEET
- VARIANT
- OF
- (in symbol CONN MICRO-SD ULTRA-LOW 8CKT) microSD card / topside

### Library data of the parts
C8 = CAP CER 10uF 25V 10% X5R 0805: 10µF ±10% 25V Ceramic Capacitor X5R 0805 (2012 Metric); Manufacturer: Murata Electronics North America; Manufacturer Part Number: GRM21BR61E106KA73L; Supplier 1: Digi-Key; RoHS: RoHS Compliant; Category: Capacitors; Stock 1: 1695157; Packaging: Cut Tape (CT); Part Status: Active; Tolerance: ±10%; Temperature Coefficient: X5R; Operating Temperature: -55°C ~ 85°C; Features: -; Ratings: -; Applications: General Purpose; Mounting Type: Surface Mount, MLCC; Package / Case: 0805 (2012 Metric); Size / Dimension: 0.079" L x 0.049" W (2.00mm x 1.25mm); Height - Seated (Max): -; Thickness (Max): 0.053" (1.35mm); Lead Spacing: -; Lead Style: -; ComponentLink1URL: http://search.murata.co.jp/Ceramy/image/img/A01X/G101/ENG/GRM21BR61E106KA73-01.pdf; ComponentLink1Description: http://search.murata.co.jp/Ceramy/image/img/A01X/G101/ENG/GRM21BR61E106KA73-01.pdf; Supplier Part Number 1: 490-5523-1-ND; Pricing 1: 1=0.3, 10=0.214, 100=0.1008, 500=0.07068, 1000=0.05851 (CAD)
C9-C11 = CAP CER 0.1UF 16V X7R 0402: as C15 on sheet MIXR Processing - STM32 USB-UART Converter; Supplier 1: Digi-Key; Supplier Part Number 1: 490-10698-1-ND; Packaging: Tape and Reel; ComponentLink1URL: http://www.farnell.com/datasheets/2048008.pdf?src-supplier=Farnell; ComponentLink1Description: http://www.farnell.com/datasheets/2048008.pdf?src-supplier=Farnell; Tolerance: 10%; RoHS: Yes; Category: Ceramic Capacitors; Stock 1: 785540; Pricing 1: 1=0.10000, 10=0.03400, 100=0.01520, 500=0.01088, 1000=0.00855, 2500=0.00778, 5000=0.00715 (USD); Mount: Surface Mount; Case/Package: 0402; Weight: 0.000212oz; Case Code (Metric): 1005; Case Code (Imperial): 0402; Dielectric Material: Ceramic; Min Operating Temperature: -55°C; Max Operating Temperature: 125°C; Termination: SMD/SMT; Composition: Ceramic; Package Quantity: 10000; Length: 1mm; Height: 0.5mm; Width: 0.02inch; Thickness: 0.022inch; Depth: 0.5mm; REACH SVHC: Unknown; Lead Free: Lead Free; ComponentLink2URL: http://uk.rs-online.com/webdocs/144c/0900766b8144c113.pdf?src-supplier=RSComponents; ComponentLink2Description: http://uk.rs-online.com/webdocs/144c/0900766b8144c113.pdf?src-supplier=RSComponents; ComponentLink3URL: http://www.farnell.com/datasheets/1872206.pdf?src-supplier=Farnell; ComponentLink3Description: http://www.farnell.com/datasheets/1872206.pdf?src-supplier=Farnell; ComponentLink4URL: http://components.arrow.com/part/dataview/0323_06361249?src-supplier=Arrow+Europe; ComponentLink4Description: http://components.arrow.com/part/dataview/0323_06361249?src-supplier=Arrow+Europe; ComponentLink5URL: http://www.mouser.com/ds/2/281/c02e-2905.pdf?src-supplier=Mouser; ComponentLink5Description: http://www.mouser.com/ds/2/281/c02e-2905.pdf?src-supplier=Mouser; ComponentLink6URL: http://www.farnell.com/datasheets/2048008.pdf?src-supplier=Newark; ComponentLink6Description: http://www.farnell.com/datasheets/2048008.pdf?src-supplier=Newark; ComponentLink7URL: http://psearch.en.murata.com/capacitor/product/GRM155R71E104KE14%23.pdf?src-supplier=Avnet; ComponentLink7Description: http://psearch.en.murata.com/capacitor/product/GRM155R71E104KE14%23.pdf?src-supplier=Avnet; ComponentLink8URL: https://search.murata.co.jp/Ceramy/image/img/A01X/G101/ENG/GRM155R71E104KE14-01.pdf?src-supplier=Digi-Key; ComponentLink8Description: https://search.murata.co.jp/Ceramy/image/img/A01X/G101/ENG/GRM155R71E104KE14-01.pdf?src-supplier=Digi-Key; ComponentLink9URL: http://www.farnell.com/datasheets/2048008.pdf?src-supplier=Element14; ComponentLink9Description: http://www.farnell.com/datasheets/2048008.pdf?src-supplier=Element14; Dielectric: X7R; Voltage Rating (DC): 25V; Voltage Rating: 25V
D1 = FILTER RLC 40 OHM/12PF/20NH SMD: RLC EMI Filter 3rd Order Low Pass 6 Channel R = 40Ohms, C = 12pF, L = 20nH 16-UFDFN Exposed Pad; Manufacturer 1: ON Semiconductor; Operating Supply Voltage: 5V; Capacitance: 20pF; Number of Channels: 6; DC Resistance (DCR): 40R; ESD Protection: Yes; Clamping Voltage: 9V; Direction: Bidirectional; Number of Lines: 8; Supplier 1: Digi-Key; Stock 1: 5050; Pricing 1: 1=0.52000, 10=0.48300, 25=0.46040, 50=0.44560, 100=0.43070, 250=0.40836, 500=0.34156, 1000=0.26507 (USD); RoHS: Yes; Case/Package: DFN; Number of Pins: 16; Contact Plating: Tin,Matte; Min Operating Temperature: -40°C; Max Operating Temperature: 85°C; Package Quantity: 1; Packaging: Tape and Reel; Termination: Flat; Length: 3.4mm; Height: 0.022inch; Width: 1.35mm; Depth: 1.45mm; REACH SVHC: No SVHC; Lead Free: Lead Free; Halogen Free: Halogen Free; ComponentLink1URL: https://datasheet.ciiva.com/1267/cm1624-d-1267908.pdf?src-supplier=Element14; ComponentLink1Description: https://datasheet.ciiva.com/1267/cm1624-d-1267908.pdf?src-supplier=Element14; ComponentLink2URL: https://datasheet.ciiva.com/4942/cm1624-d-92596-4942166.pdf?src-supplier=Mouser; ComponentLink2Description: https://datasheet.ciiva.com/4942/cm1624-d-92596-4942166.pdf?src-supplier=Mouser; ComponentLink3URL: https://datasheet.ciiva.com/26793/cm1624-08de-26793355.pdf?src-supplier=IIIC; ComponentLink3Description: https://datasheet.ciiva.com/26793/cm1624-08de-26793355.pdf?src-supplier=IIIC; ComponentLink4URL: https://datasheet.ciiva.com/1022/cm1624-d-1022810.pdf?src-supplier=Digi-Key; ComponentLink4Description: https://datasheet.ciiva.com/1022/cm1624-d-1022810.pdf?src-supplier=Digi-Key; ComponentLink5URL: https://datasheet.ciiva.com/15225/getdatasheetpartid-650344-15225530.pdf?src-supplier=Verical; ComponentLink5Description: https://datasheet.ciiva.com/15225/getdatasheetpartid-650344-15225530.pdf?src-supplier=Verical; ComponentLink6URL: https://datasheet.ciiva.com/3067/cm1624-d-3067220.pdf?src-supplier=Avnet; ComponentLink6Description: https://datasheet.ciiva.com/3067/cm1624-d-3067220.pdf?src-supplier=Avnet; ComponentLink7URL: https://datasheet.ciiva.com/3067/cm1624-d-3067221.pdf?src-supplier=Avnet; ComponentLink7Description: https://datasheet.ciiva.com/3067/cm1624-d-3067221.pdf?src-supplier=Avnet; ComponentLink8URL: https://datasheet.ciiva.com/1022/cm1624-d-1022808.pdf?src-supplier=Digi-Key; ComponentLink8Description: https://datasheet.ciiva.com/1022/cm1624-d-1022808.pdf?src-supplier=Digi-Key; ComponentLink9URL: https://datasheet.ciiva.com/1022/cm1624-d-1022809.pdf?src-supplier=Digi-Key; ComponentLink9Description: https://datasheet.ciiva.com/1022/cm1624-d-1022809.pdf?src-supplier=Digi-Key; Supplier Part Number 1: CM1624-08DEOSCT-ND
P1 = CONN MICRO-SD ULTRA-LOW 8CKT: 9 (8 + 1) Position Card Connector microSD™ Surface Mount, Right Angle Gold /; Manufacturer: Molex; Gender: Male; Number of Circuits: 8; Pitch: 1.1mm; Supplier 1: Digi-Key; RoHS: Yes; Stock 1: 36042; Pricing 1: 1 = 2.45000, 10 = 2.22400, 25 = 2.08840, 50 = 1.99740, 100 = 1.90670, 250 = 1.72508, 500 = 1.58890 (USD); Mount: Surface Mount; Contact Material: Copper Alloy; Contact Plating: Gold; Housing Material: Polymer; Min Operating Temperature: -25°C; Max Operating Temperature: 85°C; Number of Rows: 1; Package Quantity: 1600; Packaging: Tape and Reel; Connector Type: Connector; Termination: Solder; Orientation: Right Angle; Length: 15.2mm; Depth: 14.95mm; REACH SVHC: No SVHC; Halogen Free: Low Halogen; Supplier Part Number 1: WM12834CT-ND
R15 R17 = RES 10K OHM 1% 1/16W 0402: Surface Mount Thick Film Resistor, Rc Series, 10 Kohm, 62.5 Mw, - 1%, 50 V, 0402 [1005 Metric]; Manufacturer: Yageo; Manufacturer Part Number: RC0402FR-0710KL; Temperature Coefficient: 100ppm/°C; Voltage Rating: 50V; Power Rating: 62.5mW; Supplier 1: Digi-Key; Supplier Part Number 1: 311-10.0KLRCT-ND; Packaging: Tape and Reel; Composition: Thick Film; ComponentLink1URL: https://datasheet.ciiva.com/7660/38568-7660787.pdf?src-supplier=Element14; ComponentLink1Description: https://datasheet.ciiva.com/7660/38568-7660787.pdf?src-supplier=Element14; Tolerance: 1%; RoHS: Yes; Category: Chip SMD Resistors; Stock 1: 60761136; Pricing 1: 1=0.10000, 10=0.01600, 100=0.00640, 1000=0.00289, 2500=0.00251, 5000=0.00207 (USD); Case/Package: 0402; Number of Pins: 2; Case Code (Imperial): 0402; Case Code (Metric): 1005; Min Operating Temperature: -55°C; Max Operating Temperature: 155°C; Voltage Rating (DC): 50V; Termination: SMD/SMT; Military Standard: Not; Working Voltage: 50V; Number of Terminations: 2; Length: 1mm; Height: 0.32mm; Width: 0.5mm; Depth: 0.5mm; Lead Pitch: 0.2mm; REACH SVHC: No SVHC; Lead Free: Lead Free; ComponentLink2URL: https://datasheet.ciiva.com/7983/1018594-7983486.pdf?src-supplier=Element14; ComponentLink2Description: https://datasheet.ciiva.com/7983/1018594-7983486.pdf?src-supplier=Element14; ComponentLink3URL: https://datasheet.ciiva.com/7849/1784430-7849813.pdf?src-supplier=Element14; ComponentLink3Description: https://datasheet.ciiva.com/7849/1784430-7849813.pdf?src-supplier=Element14; ComponentLink4URL: https://datasheet.ciiva.com/7849/1686128-7849814.pdf?src-supplier=Element14; ComponentLink4Description: https://datasheet.ciiva.com/7849/1686128-7849814.pdf?src-supplier=Element14; ComponentLink5URL: https://datasheet.ciiva.com/7849/1784430-7849815.pdf?src-supplier=Element14; ComponentLink5Description: https://datasheet.ciiva.com/7849/1784430-7849815.pdf?src-supplier=Element14; ComponentLink6URL: https://datasheet.ciiva.com/22747/1018594-22747512.pdf?src-supplier=Element14; ComponentLink6Description: https://datasheet.ciiva.com/22747/1018594-22747512.pdf?src-supplier=Element14; ComponentLink7URL: https://datasheet.ciiva.com/12667/pyu-rc0402-51-rohs-l-6-r-12667067.pdf?src-supplier=Mouser; ComponentLink7Description: https://datasheet.ciiva.com/12667/pyu-rc0402-51-rohs-l-6-r-12667067.pdf?src-supplier=Mouser
R16 = RES 0.0 OHM 1% 1/16W 0402: RES SMD 0 OHM JUMPER 1/16W 0402; Manufacturer: Yageo; Manufacturer Part Number: RC0402JR-070RL; Power Rating: 62.5mW; Voltage Rating: 50V; Max Power Dissipation: 63mW; Temperature Coefficient: 200ppm/°C; Tolerance: 5%; Supplier 1: Digi-Key; Supplier Part Number 1: 311-0.0JRCT-ND; Packaging: Tape and Reel; Composition: Thick Film; ComponentLink1URL: https://datasheet.ciiva.com/2452/pyu-rc0402-51-rohs-l-6-2452608.pdf?src-supplier=Digi-Key; ComponentLink1Description: https://datasheet.ciiva.com/2452/pyu-rc0402-51-rohs-l-6-2452608.pdf?src-supplier=Digi-Key; RoHS: Yes; Category: Chip SMD Resistors; Stock 1: 49427466; Pricing 1: 1=0.10000, 10=0.01300, 25=0.00920, 50=0.00720, 100=0.00530, 250=0.00400, 500=0.00320, 1000=0.00236, 5000=0.00169 (USD); Case/Package: 0402; Contact Plating: Tin,Matte; Case Code (Metric): 1005; Case Code (Imperial): 0402; Min Operating Temperature: -55°C; Max Operating Temperature: 155°C; Package Quantity: 1; Number of Terminations: 2; Termination: SMD/SMT; Military Standard: Not; Features: Moisture Resistant; Length: 1mm; Height: 0.016inch; Width: 0.02inch; Depth: 0.5mm; Radiation Hardening: No; REACH SVHC: Unknown; Lead Free: Lead Free; ComponentLink2URL: https://datasheet.ciiva.com/11808/0900766b80c66297-11808195.pdf?src-supplier=RSComponents; ComponentLink2Description: https://datasheet.ciiva.com/11808/0900766b80c66297-11808195.pdf?src-supplier=RSComponents; ComponentLink3URL: https://datasheet.ciiva.com/2452/pyu-r-int-thick-7-2452609.pdf?src-supplier=Digi-Key; ComponentLink3Description: https://datasheet.ciiva.com/2452/pyu-r-int-thick-7-2452609.pdf?src-supplier=Digi-Key; ComponentLink4URL: https://datasheet.ciiva.com/2452/pyu-r-int-thick-7-2452610.pdf?src-supplier=Digi-Key; ComponentLink4Description: https://datasheet.ciiva.com/2452/pyu-r-int-thick-7-2452610.pdf?src-supplier=Digi-Key; ComponentLink5URL: https://datasheet.ciiva.com/8896/pyu-rc0402-51-rohs-l-6-8896201.pdf?src-supplier=Avnet; ComponentLink5Description: https://datasheet.ciiva.com/8896/pyu-rc0402-51-rohs-l-6-8896201.pdf?src-supplier=Avnet; ComponentLink6URL: https://datasheet.ciiva.com/28386/pyu-rc0402-51-rohs-l-6-28386633.pdf?src-supplier=Avnet+Europe; ComponentLink6Description: https://datasheet.ciiva.com/28386/pyu-rc0402-51-rohs-l-6-28386633.pdf?src-supplier=Avnet+Europe; ComponentLink7URL: https://datasheet.ciiva.com/22747/1018594-22747515.pdf?src-supplier=Element14; ComponentLink7Description: https://datasheet.ciiva.com/22747/1018594-22747515.pdf?src-supplier=Element14; ComponentLink8URL: https://datasheet.ciiva.com/15189/getdatasheetpartid-326379-15189533.pdf?src-supplier=Verical; ComponentLink8Description: https://datasheet.ciiva.com/15189/getdatasheetpartid-326379-15189533.pdf?src-supplier=Verical; ComponentLink9URL: https://datasheet.ciiva.com/7983/1018594-7983535.pdf?src-supplier=Element14; ComponentLink9Description: https://datasheet.ciiva.com/7983/1018594-7983535.pdf?src-supplier=Element14
U2 U3 = IC MUX/DEMUX 4-BIT 1-OF-2 16-TSSOP: TEXAS INSTRUMENTS         SN74CBTLV3257PWR            1 TO 2 QUAD FET MUX/DEMUX, TSSOP-16; Bandwidth: 200MHz; Propagation Delay: 0.25ns; Number of Channels: 4; Min Supply Voltage: 2.3V; Max Supply Voltage: 3.6V; Logic Function: Multiplexer,Demultiplexer; Number of Elements: 1; Number of Inputs: 8; On-State Resistance: 40R; Operating Supply Current: 10uA; High Level Output Current: -128mA; Low Level Output Current: 128mA; Turn-On Delay Time: 6.1ns; Supply Type: Single; Polarity: Non-Inverting; Throw Configuration: SPDT; Supplier 1: Digi-Key; Manufacturer: Texas Instruments; RoHS: Yes; Category: Decoders, Multiplexers; Stock 1: 31974; Pricing 1: 1=0.71000, 10=0.62900, 25=0.59080, 100=0.48210, 250=0.44780, 500=0.38110, 1000=0.30488 (USD); Mount: Surface Mount; Case/Package: TSSOP; Number of Pins: 16; Weight: 0.002081oz; Contact Plating: Gold; Min Operating Temperature: -40°C; Max Operating Temperature: 85°C; Packaging: Tape and Reel; Package Quantity: 1; Number of Outputs: 4; Number of Bits: 8; Quiescent Current: 10uA; Independent Circuits: 1; Length: 5mm; Height: 1.15mm; Width: 4.4mm; Radiation Hardening: No; REACH SVHC: No SVHC; Lead Free: Lead Free; ComponentLink1URL: https://datasheet.ciiva.com/15096/getdatasheetpartid-475832-15096886.pdf?src-supplier=Verical; ComponentLink1Description: https://datasheet.ciiva.com/15096/getdatasheetpartid-475832-15096886.pdf?src-supplier=Verical; ComponentLink2URL: https://datasheet.ciiva.com/34301/914507-34301751.pdf?src-supplier=Jameco; ComponentLink2Description: https://datasheet.ciiva.com/34301/914507-34301751.pdf?src-supplier=Jameco; ComponentLink3URL: https://datasheet.ciiva.com/26866/sn74cbtlv3257pwr-26866949.pdf?src-supplier=IIIC; ComponentLink3Description: https://datasheet.ciiva.com/26866/sn74cbtlv3257pwr-26866949.pdf?src-supplier=IIIC; ComponentLink4URL: https://datasheet.ciiva.com/41457/001016561-da-01-en-ic-4b-1of-sn74cbtlv3257pwr-tssop-16-tid-41457145.pdf?src-supplier=Conrad; ComponentLink4Description: https://datasheet.ciiva.com/41457/001016561-da-01-en-ic-4b-1of-sn74cbtlv3257pwr-tssop-16-tid-41457145.pdf?src-supplier=Conrad; ComponentLink5URL: https://datasheet.ciiva.com/1888/sn74cbtlv3257-1888771.pdf?src-supplier=Digi-Key; ComponentLink5Description: https://datasheet.ciiva.com/1888/sn74cbtlv3257-1888771.pdf?src-supplier=Digi-Key; ComponentLink6URL: https://datasheet.ciiva.com/1888/sn74cbtlv3257-1888772.pdf?src-supplier=Digi-Key; ComponentLink6Description: https://datasheet.ciiva.com/1888/sn74cbtlv3257-1888772.pdf?src-supplier=Digi-Key; ComponentLink7URL: https://datasheet.ciiva.com/1509/1634002-1509116.pdf?src-supplier=Element14; ComponentLink7Description: https://datasheet.ciiva.com/1509/1634002-1509116.pdf?src-supplier=Element14; ComponentLink8URL: https://datasheet.ciiva.com/3169/sn74cbtlv3257-3169116.pdf?src-supplier=Avnet; ComponentLink8Description: https://datasheet.ciiva.com/3169/sn74cbtlv3257-3169116.pdf?src-supplier=Avnet; ComponentLink9URL: https://datasheet.ciiva.com/25917/sn74cbtlv3257-25917342.pdf?src-supplier=Avnet+Europe; ComponentLink9Description: https://datasheet.ciiva.com/25917/sn74cbtlv3257-25917342.pdf?src-supplier=Avnet+Europe; Supplier Part Number 1: 296-9138-1-ND; ComponentLink10URL: https://datasheet.ciiva.com/3169/sn74cbtlv3257-3169117.pdf?src-supplier=Avnet; ComponentLink10Description: https://datasheet.ciiva.com/3169/sn74cbtlv3257-3169117.pdf?src-supplier=Avnet; ComponentLink11URL: https://datasheet.ciiva.com/1888/sn74cbtlv3257-1888773.pdf?src-supplier=Digi-Key; ComponentLink11Description: https://datasheet.ciiva.com/1888/sn74cbtlv3257-1888773.pdf?src-supplier=Digi-Key; ComponentLink12URL: https://datasheet.ciiva.com/46395/1882419-46395595.pdf?src-supplier=Element14; ComponentLink12Description: https://datasheet.ciiva.com/46395/1882419-46395595.pdf?src-supplier=Element14